# Altium schematic sheet Fuel-Gauge.SchDoc
size B; SheetNumber: 4; SheetTotal: 15
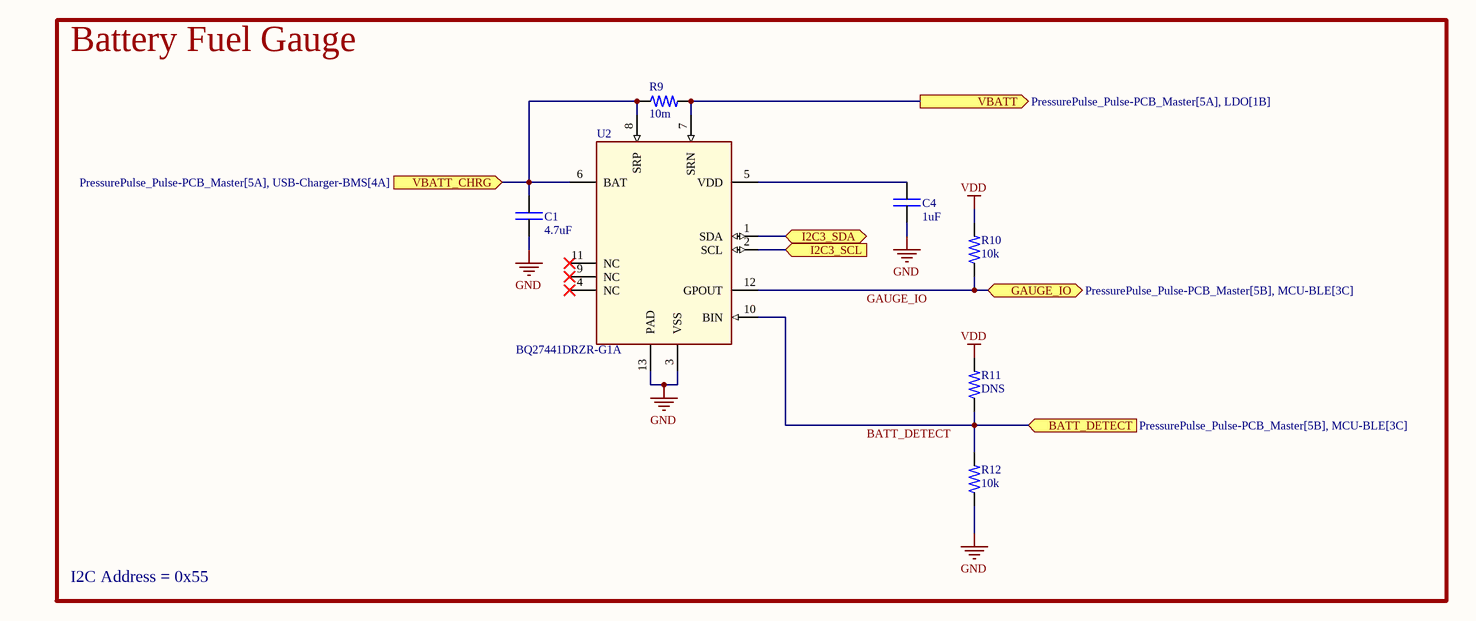
[diagram p0: Fuel-Gauge.SchDoc]

## Parts
C1  value 4.7uF  [0402C]  (hidden comment: CAP)
C4  value 1uF  [0402C]  (hidden comment: CAP)
R9  value 10m  [0805R]  (hidden comment: RES)
R10  value 10k  [0402R]  (hidden comment: RES)
R11  value DNS  [0402R]  (hidden comment: RES)
R12  value 10k  [0402R]  (hidden comment: RES)
U2  BQ27441DRZR-G1A  [bq27441-G1]

## Ports
BATT_DETECT (in, see PressurePulse_Pulse-PCB_Master[5B], MCU-BLE[3C]), GAUGE_IO (bidir, see PressurePulse_Pulse-PCB_Master[5B], MCU-BLE[3C]), I2C3_SCL (in, see PressurePulse_Pulse-PCB_Master[5B], Gyroscope[1C], MCU-BLE[2C]), I2C3_SDA (bidir, see PressurePulse_Pulse-PCB_Master[5A], Gyroscope[1C], MCU-BLE[2C]), VBATT (out, see PressurePulse_Pulse-PCB_Master[5A], LDO[1B]), VBATT_CHRG (in, see PressurePulse_Pulse-PCB_Master[5A], USB-Charger-BMS[4A])

## Nets
GND: C1.1 C4.1 R12.1 U2.3(VSS) U2.13(PAD)
VDD: R10.2 R11.2
BATT_DETECT: R11.1 R12.2 U2.10(BIN) ; port BATT_DETECT
GAUGE_IO: R10.1 U2.12(GPOUT) ; port GAUGE_IO
I2C3_SCL: U2.2(SCL) ; port I2C3_SCL
I2C3_SDA: U2.1(SDA) ; port I2C3_SDA
VBATT: R9.2 U2.7(SRN) ; port VBATT
VBATT_CHRG: C1.2 R9.1 U2.6(BAT) U2.8(SRP) ; port VBATT_CHRG
NetC4_2: C4.2 U2.5(VDD)

Not connected (* = marked no-connect by the designer): U2 4(NC)* 9(NC)* 11(NC)*

## Notes on the sheet
- Battery Fuel Gauge
- I2C Address = 0x55

## Library data of the parts
C1 C4 = CAP: Capacitor; MFR: *; MFR PN: *; JLCPCB PN: *; Footprint: *
R9 = RES: Resistor; MFR PN: RL0805FR-070R01L; MFR: YAGEO; Tolerance: 1%; JLCPCB PN: C728467
R10-R12 = RES: Resistor; MFR PN: *; MFR: *; JLCPCB PN: *
U2 = BATT FUEL GAUGE: No Description Available; MFR: Texas Instruments; Value: BQ27441DRZR-G1A; JLCPCB PN: C473397; MFR PN: BQ27441DRZR-G1A